# EAGLE design RPixel_V1 (EAGLE 9.5.2)

## Sheet 1 of 2
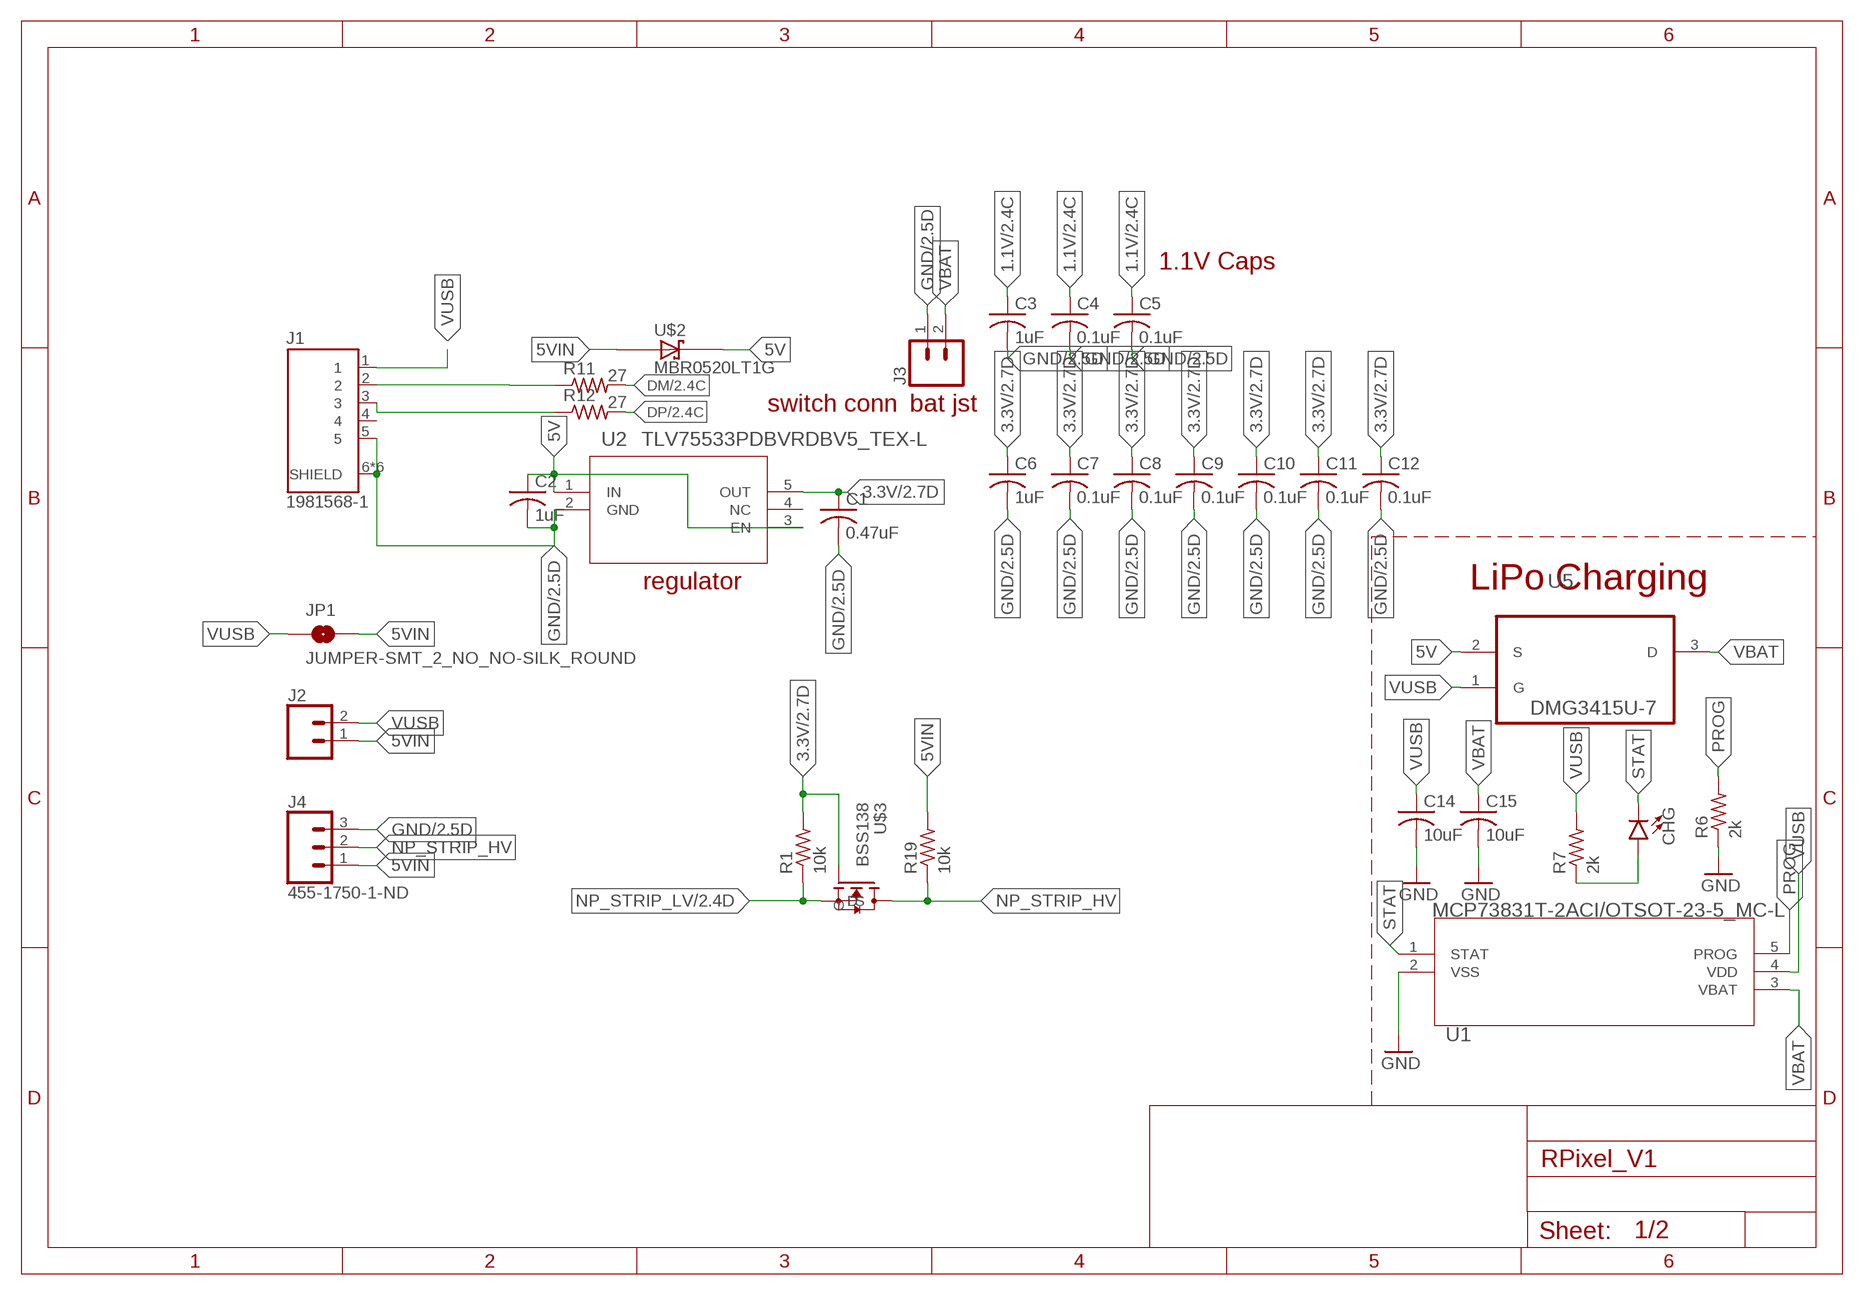
[diagram p0: schematic, sheet 1]

### Parts
C1  0.47uF  C-USC0805  [C0805]
C2  1uF  C-USC0805  [C0805]
C3  1uF  C-USC0402  [C0402]
C4  0.1uF  C-USC0402  [C0402]
C5  0.1uF  C-USC0402  [C0402]
C6  1uF  C-USC0402  [C0402]
C7  0.1uF  C-USC0402  [C0402]
C8  0.1uF  C-USC0402  [C0402]
C9  0.1uF  C-USC0402  [C0402]
C10  0.1uF  C-USC0402  [C0402]
C11  0.1uF  C-USC0402  [C0402]
C12  0.1uF  C-USC0402  [C0402]
C14  10uF  C-USC0603  [C0603]
C15  10uF  C-USC0603  [C0603]
CHG  LED0603  [LED-0603]
J1  1981568-1  [TE_1981568-1]
J2  CONN_02  [1X02]
J3  CONN_02-JST-2MM-SMT  [JST-2-SMD]
J4  455-1750-1-ND  CONN_03  [1X03]
JP1  JUMPER-SMT_2_NO_NO-SILK_ROUND  [SMT-JUMPER_2_NO_NO-SILK_ROUND]
R1  10k  R-US_R0603  [R0603]
R6  2k  R-US_R0603  [R0603]
R7  2k  R-US_R0603  [R0603]
R11  27  R-US_R0603  [R0603]
R12  27  R-US_R0603  [R0603]
R19  10k  R-US_R0603  [R0603]
U1  MCP73831T-2ACI/OTSOT-23-5_MC-L  [SOT-23-5_MC-L]
U2  TLV75533PDBVRDBV5_TEX-L  [DBV5_TEX-L]
U5  DMG3415U-7  [SOT95P240X105-3N]
U$2  MBR0520LT1G  [SOD3716X117(SOD-123)]
U$3  BSS138  [BSS138]

### Nets
1.1V: C3.1 C4.1 C5.1 ; also sheet 2
3.3V: C1.1 C6.1 C7.1 C8.1 C9.1 C10.1 C11.1 C12.1 R1.2 U2.5(OUT) U$3.G ; also sheet 2
5V: C2.1 U2.1(IN) U2.3(EN) U5.2(S) U$2.1(C)
5VIN: J2.1 J4.1 JP1.2 R19.2 U$2.2(A)
DM: R11.2 ; also sheet 2
DP: R12.2 ; also sheet 2
GND: C1.2 C2.2 C3.2 C4.2 C5.2 C6.2 C7.2 C8.2 C9.2 C10.2 C11.2 C12.2 C14.2 C15.2 J1.5 J1.6(SHIELD) J1.7(SHIELD) J1.8(SHIELD) J1.9(SHIELD) J1.10(SHIELD) J1.11(SHIELD) J3.1 J4.3 R6.1 U1.2(VSS) U2.2(GND) ; also sheet 2
N$1: CHG.A R7.1
N$4: J1.3 R12.1
N$11: J1.2 R11.1
NP_STRIP_HV: J4.2 R19.1 U$3.D
NP_STRIP_LV: R1.1 U$3.S ; also sheet 2
PROG: R6.2 U1.5(PROG)
STAT: CHG.C U1.1(STAT)
VBAT: C15.1 J3.2 U1.3(VBAT) U5.3(D)
VUSB: C14.1 J1.1 J2.2 JP1.1 R7.2 U1.4(VDD) U5.1(G)
Unconnected: J1.4 U2.4(NC)

### Notes on the sheet
- 1.1V Caps
- switch conn | bat jst
- regulator | LiPo Charging

## Sheet 2 of 2
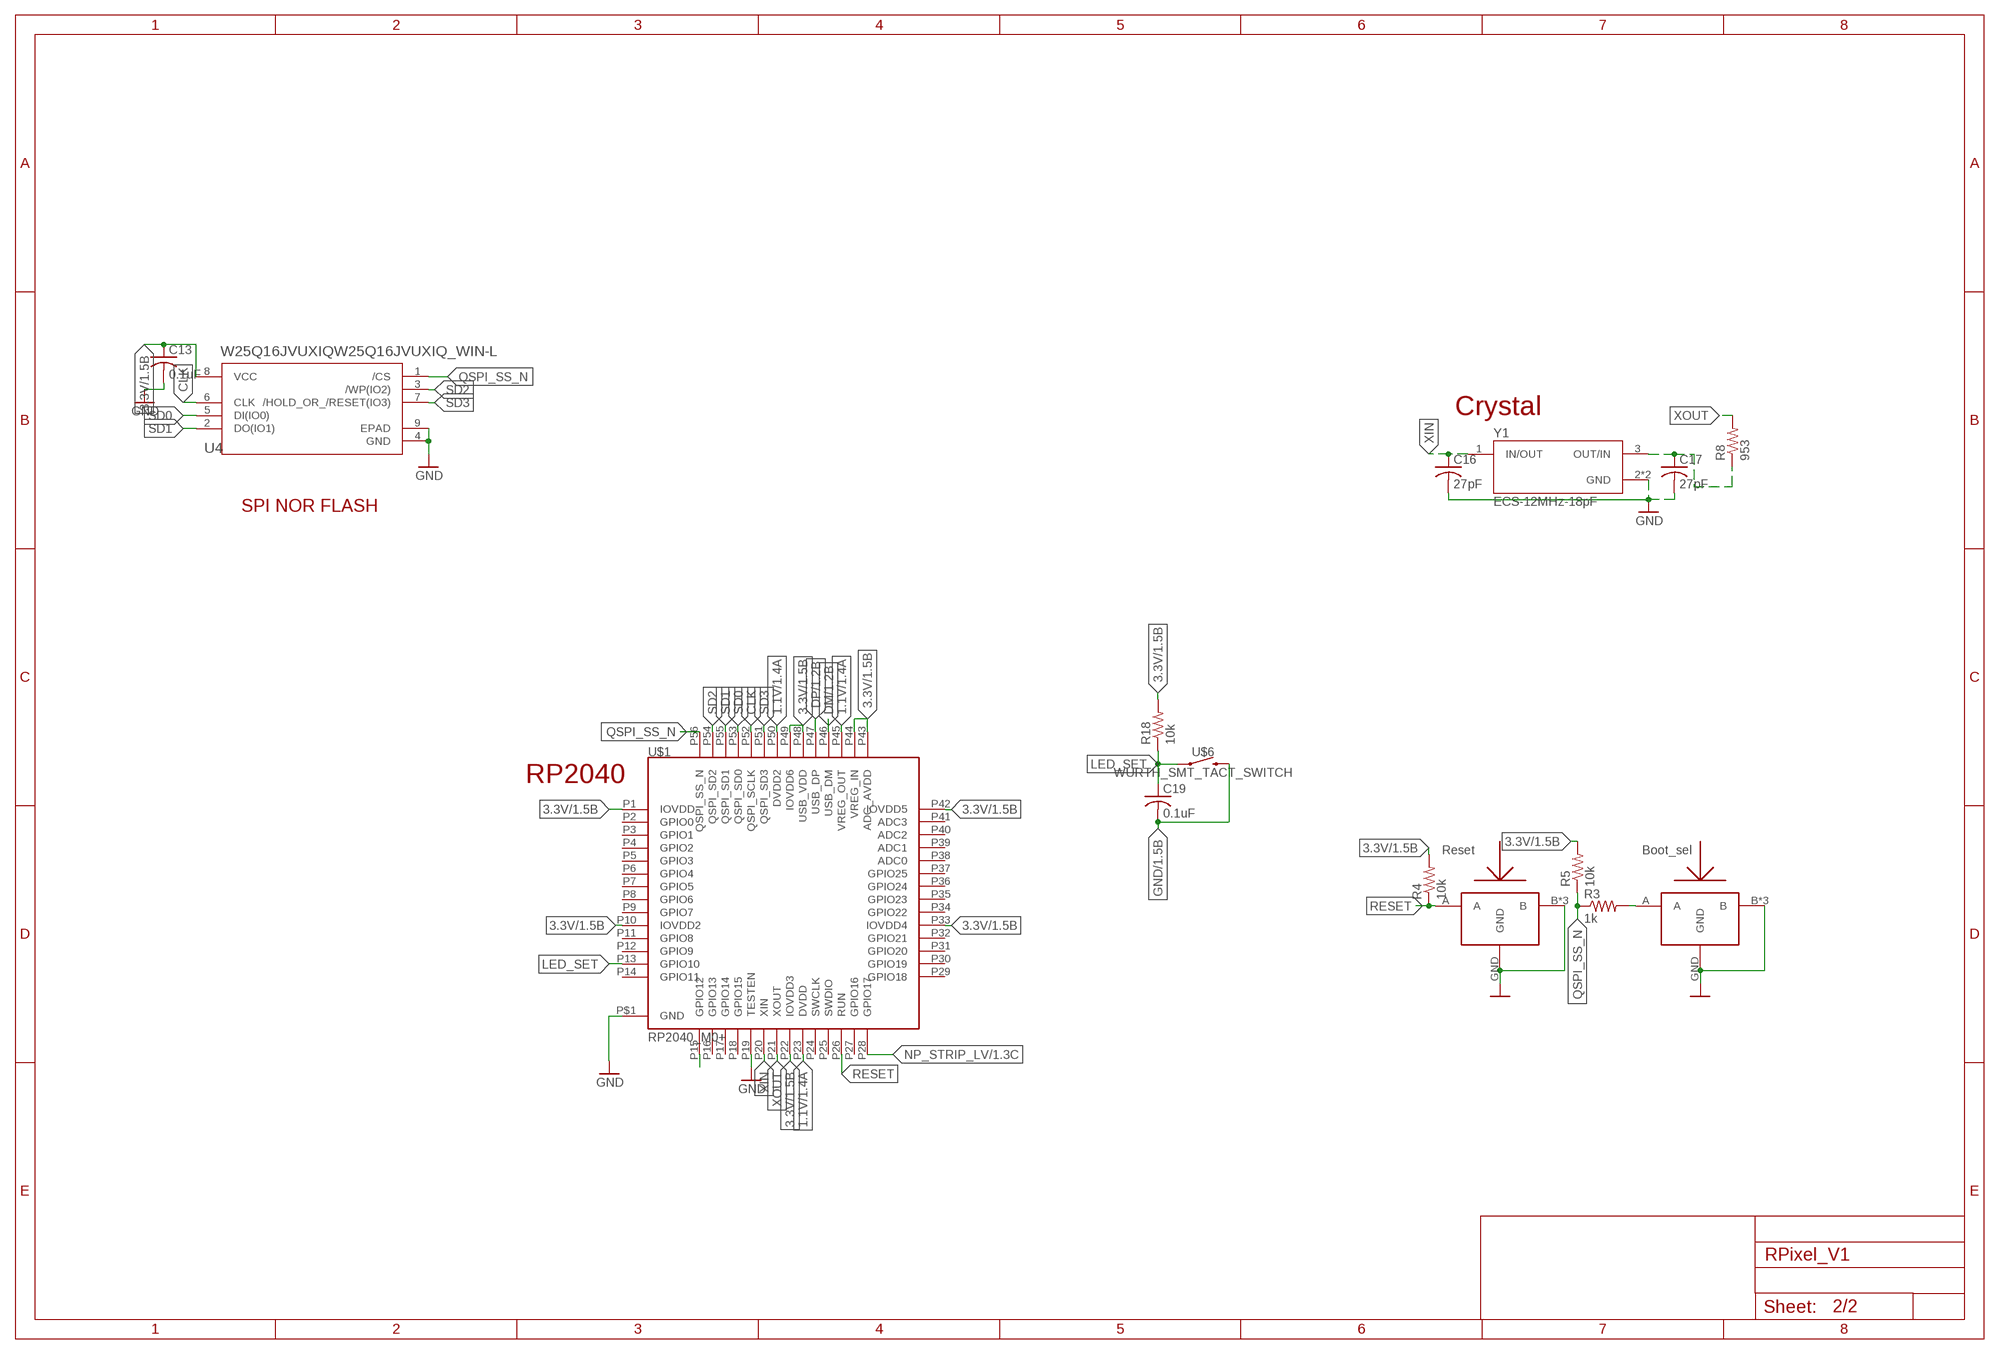
[diagram p1: schematic, sheet 2]

### Parts
C13  0.1uF  C-USC0402  [C0402]
C16  27pF  C-USC0402  [C0402]
C17  27pF  C-USC0402  [C0402]
C19  0.1uF  C-USC0402  [C0402]
R3  1k  R-US_R0402  [R0402]
R4  10k  R-US_R0402  [R0402]
R5  10k  R-US_R0402  [R0402]
R8  953  R-US_R0402  [R0402]
R18  10k  R-US_R0402  [R0402]
U4  W25Q16JVUXIQW25Q16JVUXIQ_WIN-L  [W25Q16JVUXIQ_WIN-L]
U$1  RP2040_M0+  [QFN-56]
U$4  SOF-232HST  [3.3X2.9]
U$5  SOF-232HST  [3.3X2.9]
U$6  WURTH_SMT_TACT_SWITCH  [SIDE_MOUNT_SWITCH]
Y1  ECS-12MHz-18pF  ECS-327ATQMV-AS-TR  [XTAL_ECS-327ATQMV-AS-TR]

### Nets
1.1V: U$1.P23(DVDD) U$1.P45(VREG_OUT) U$1.P50(DVDD2) ; also sheet 1
3.3V: C13.1 R4.2 R5.2 R18.2 U4.8(VCC) U$1.P1(IOVDD) U$1.P10(IOVDD2) U$1.P22(IOVDD3) U$1.P33(IOVDD4) U$1.P42(IOVDD5) U$1.P43(ADC_AVDD) U$1.P44(VREG_IN) U$1.P48(USB_VDD) U$1.P49(IOVDD6) ; also sheet 1
CLK: U4.6(CLK) U$1.P52(QSPI_SCLK)
DM: U$1.P46(USB_DM) ; also sheet 1
DP: U$1.P47(USB_DP) ; also sheet 1
GND: C13.2 C16.2 C17.2 C19.2 U4.4(GND) U4.9(EPAD) U$1.P19(TESTEN) U$1.P$1(GND) U$4.B U$4.B2(B) U$4.B3(B) U$4.GND U$5.B U$5.B2(B) U$5.B3(B) U$5.GND U$6.2 Y1.2(GND) Y1.4(GND) ; also sheet 1
LED_SET: C19.1 R18.1 U$1.P13(GPIO10) U$6.1
N$2: R3.2 U$5.A
N$6: C17.1 R8.1 Y1.3(OUT/IN)
NP_STRIP_LV: U$1.P28(GPIO17) ; also sheet 1
QSPI_SS_N: R3.1 R5.1 U4.1(/CS) U$1.P56(QSPI_SS_N)
RESET: R4.1 U$1.P26(RUN) U$4.A
SD0: U4.5(DI(IO0)) U$1.P53(QSPI_SD0)
SD1: U4.2(DO(IO1)) U$1.P55(QSPI_SD1)
SD2: U4.3(/WP(IO2)) U$1.P54(QSPI_SD2)
SD3: U4.7(/HOLD_OR_/RESET(IO3)) U$1.P51(QSPI_SD3)
SDA: U$1.P15(GPIO12)
XIN: C16.1 U$1.P20(XIN) Y1.1(IN/OUT)
XOUT: R8.2 U$1.P21(XOUT)
Unconnected: U$1.P2(GPIO0) U$1.P3(GPIO1) U$1.P4(GPIO2) U$1.P5(GPIO3) U$1.P6(GPIO4) U$1.P7(GPIO5) U$1.P8(GPIO6) U$1.P9(GPIO7) U$1.P11(GPIO8) U$1.P12(GPIO9) U$1.P14(GPIO11) U$1.P16(GPIO13) U$1.P17(GPIO14) U$1.P18(GPIO15) U$1.P24(SWCLK) U$1.P25(SWDIO) U$1.P27(GPIO16) U$1.P29(GPIO18) U$1.P30(GPIO19) U$1.P31(GPIO20) U$1.P32(GPIO21) U$1.P34(GPIO22) U$1.P35(GPIO23) U$1.P36(GPIO24) U$1.P37(GPIO25) U$1.P38(ADC0) U$1.P39(ADC1) U$1.P40(ADC2) U$1.P41(ADC3)

### Notes on the sheet
- Crystal
- SPI NOR FLASH
- RP2040
- Reset | Boot_sel

## Library data of the parts
C1-C17 C19 = rcl:C-US: CAPACITOR, American symbol; SPICEPREFIX: C
CHG = SparkFun-LED:LED: LED (Generic) Standard schematic elements and footprints for 5mm, 3mm, 1206, and 0603 sized LEDs. Generic LEDs with no color specified.
J1 = 1981568-1:1981568-1: CONN RCPT MICRO USB B R/A SMD; AVAILABILITY: Unavailable; DESCRIPTION: USB - micro B USB 2.0 Receptacle Connector 5 Position Surface Mount, Right Angle; MF: TE Connectivity; MP: 19815681; PACKAGE: None; PRICE: None; TE_PURCHASE_URL: https://www.te.com/usa-en/product-19815681.html?te_bu=Cor&te_type=disp&te_campaign=seda_glo_cor-seda-global-disp-prtnr-fy19-seda-model-bom-cta_sma-317_1&elqCampaignId=32493
J2 = SparkFun-Connectors:CONN_02: Multi connection point. Often used as Generic Header-pin footprint for 0.1 inch spaced/style header connections On any of the 0.1 inch spaced packages, you can populate with these: Break Away Headers - Straight <https://www.sparkfun.com/products/116> (PRT-00116) Break Away Male Headers - Right Angle <https://www.sparkfun.com/products/553> (PRT-00553) Female Headers <https://www.sparkfun.com/products/115> (PRT-00115) Break Away Headers - Machine Pin <https://www.sparkfun.com/products/117> (PRT-00117) Break Away Female Headers - Swiss Machine Pin <https://www.sparkfun.com/products/743> (PRT-00743) For SCREWTERMINALS and SPRING TERMINALS visit here: Screw Terimnals on SparkFun.com <https://www.sparkfun.com/search/results?term=Screw+Terminals> (5mm/3.5mm/2.54mm spacing) This device is also useful as a general connection point to wire up your design to another part of your project. Our various solder wires solder well into these plated through hole pads. Hook-Up Wire - Assortment (Stranded, 22 AWG) <https://www.sparkfun.com/products/11375> (PRT-11375) Hook-Up Wire - Assortment (Solid Core, 22 AWG) <https://www.sparkfun.com/products/11367> (PRT-11367) View the entire wire category on our website here <https://www.sparkfun.com/categories/141> Special notes: Molex polarized connector foot print use with: PRT-08233 with associated crimp pins and housings. 2.54_SCREWTERM for use with PRT-10571. 3.5mm Screw Terminal footprints for PRT-08084 5mm Screw Terminal footprints for use with PRT-08432
J3 = SparkFun-Connectors:CONN_02: Multi connection point. Often used as Generic Header-pin footprint for 0.1 inch spaced/style header connections On any of the 0.1 inch spaced packages, you can populate with these: Break Away Headers - Straight <https://www.sparkfun.com/products/116> (PRT-00116) Break Away Male Headers - Right Angle <https://www.sparkfun.com/products/553> (PRT-00553) Female Headers <https://www.sparkfun.com/products/115> (PRT-00115) Break Away Headers - Machine Pin <https://www.sparkfun.com/products/117> (PRT-00117) Break Away Female Headers - Swiss Machine Pin <https://www.sparkfun.com/products/743> (PRT-00743) For SCREWTERMINALS and SPRING TERMINALS visit here: Screw Terimnals on SparkFun.com <https://www.sparkfun.com/search/results?term=Screw+Terminals> (5mm/3.5mm/2.54mm spacing) This device is also useful as a general connection point to wire up your design to another part of your project. Our various solder wires solder well into these plated through hole pads. Hook-Up Wire - Assortment (Stranded, 22 AWG) <https://www.sparkfun.com/products/11375> (PRT-11375) Hook-Up Wire - Assortment (Solid Core, 22 AWG) <https://www.sparkfun.com/products/11367> (PRT-11367) View the entire wire category on our website here <https://www.sparkfun.com/categories/141> Special notes: Molex polarized connector foot print use with: PRT-08233 with associated crimp pins and housings. 2.54_SCREWTERM for use with PRT-10571. 3.5mm Screw Terminal footprints for PRT-08084 5mm Screw Terminal footprints for use with PRT-08432; PROD_ID: CONN-11443
J4 = SparkFun-Connectors:CONN_03: Multi connection point. Often used as Generic Header-pin footprint for 0.1 inch spaced/style header connections On any of the 0.1 inch spaced packages, you can populate with these: Break Away Headers - Straight <https://www.sparkfun.com/products/116> (PRT-00116) Break Away Male Headers - Right Angle <https://www.sparkfun.com/products/553> (PRT-00553) Female Headers <https://www.sparkfun.com/products/115> (PRT-00115) Break Away Headers - Machine Pin <https://www.sparkfun.com/products/117> (PRT-00117) Break Away Female Headers - Swiss Machine Pin <https://www.sparkfun.com/products/743> (PRT-00743) Stackable Header - 3 Pin (Female, 0.1") <https://www.sparkfun.com/products/13875> (PRT-13875) For SCREWTERMINALS and SPRING TERMINALS visit here: Screw Terimnals on SparkFun.com <https://www.sparkfun.com/search/results?term=Screw+Terminals> (5mm/3.5mm/2.54mm spacing) This device is also useful as a general connection point to wire up your design to another part of your project. Our various solder wires solder well into these plated through hole pads. Hook-Up Wire - Assortment (Stranded, 22 AWG) <https://www.sparkfun.com/products/11375> (PRT-11375) Hook-Up Wire - Assortment (Solid Core, 22 AWG) <https://www.sparkfun.com/products/11367> (PRT-11367) View the entire wire category on our website here <https://www.sparkfun.com/categories/141> Special notes: Molex polarized connector foot print use with SKU : PRT-08232 with associated crimp pins and housings.; PROD_ID: XXX-00000
JP1 = SparkFun-Jumpers:JUMPER-SMT_2_NO: Normally open jumper This jumper has two pads in close proximity to each other. Apply solder to close the connection. Round pads are easier to solder for beginners, but are a lot larger. SparkFun Product that uses the round pads: SparkFun EL Sequencer <https://www.sparkfun.com/products/12781>
R1 R3-R8 R11 R12 R18 R19 = rcl:R-US_: RESISTOR, American symbol; SPICEPREFIX: R
U1 = MCP73831-2ACI:MCP73831T-2ACI/OT; BUILT_BY: EMA_UL_Team; MANUFACTURER_PART_NUMBER: MCP73831T-2ACI/OT; VENDOR: Microchip
U2 = TLV75533pdbvr:TLV75533PDBVR; COPYRIGHT: Copyright (C) 2018 Accelerated Designs. All rights reserved; MANUFACTURER_PART_NUMBER: TLV75533PDBVR; SOURCELIBRARY: TI_2019-06-18; VENDOR: Texas Instruments
U4 = Winbond SPI Flash:W25Q16JVUXIQ; BUILT_BY: EMA_Colton; COPYRIGHT: Copyright (C) 2018 Accelerated Designs. All rights reserved; DATASHEET: https://www.mouser.com/datasheet/2/949/w25n01gw_reve_021318_unsecured-1489855.pdf; MANUFACTURER_PART_NUMBER: W25Q16JVUXIQ; SOURCELIBRARY: Winbond_2020-03-18; VENDOR: Winbond
U5 = DMG3415U-7:DMG3415U-7: P-CHANNEL ENHANCEMENT MODE MOSFET; AVAILABILITY: Unavailable; DESCRIPTION: P-Channel 20V 4A _Ta_ 900mW _Ta_ Surface Mount SOT-23-3; MF: Diodes Inc.; MP: DMG3415U-7; PACKAGE: SOT-23-3 Diodes Inc.; PRICE: None
U$1 = RP2040_M0:RP2040_M0+
U$2 = MBR0520LT1G:MBR0520LT1G: Surface Mount Schottky Power Rectifier Plastic SOD−123 Package; AVAILABILITY: Unavailable; DESCRIPTION: Diode Schottky 20V 500mA Surface Mount SOD-123; MF: ON Semiconductor; MP: MBR0520LT1G; PACKAGE: SOD-123 ON Semiconductor; PRICE: None
U$3 = BSS138:BSS138: BSS138 N-Channel Logic Level Enhancement Mode Field Effect Transistor; AVAILABILITY: Unavailable; DESCRIPTION: N-Channel 50V 220mA _Ta_ 360mW _Ta_ Surface Mount Die; MF: MICROSS/On Semiconductor; MP: BSS138; PACKAGE: TO-236-3 Micross; PRICE: None
U$4 U$5 = Mitsumi Buttons:SOF-232HST
U$6 = Wurth Switches:WURTH_SMT_TACT_SWITCH
Y1 = ECS-327ATQMV-AS-TR:ECS-327ATQMV-AS-TR: The ECX-33Q is a miniature SMD Crystal with a 3.2 x 2.5 mm footprint. AEC-Q200 Qualified.; ARROW_ELECTRONICS-PURCHASE-URL: https://snapeda.com/shop?store=Arrow+Electronics&id=3210300; DESCRIPTION: 32.768kHz XO (Standard) CMOS Oscillator 1.62V ~ 3.63V Enable/Disable 4-SMD, No Lead; DIGI-KEY_PART_NUMBER: XC2826CT-ND; MF: ECS Inc.; MOUSER-PURCHASE-URL: https://snapeda.com/shop?store=Mouser&id=3210300; MP: ECS-327ATQMV-AS-TR; PACKAGE: SMD-4 ECS Inc.

## Net classes
0 default: width 0.152 mm, clearance 0.127 mm

## Board
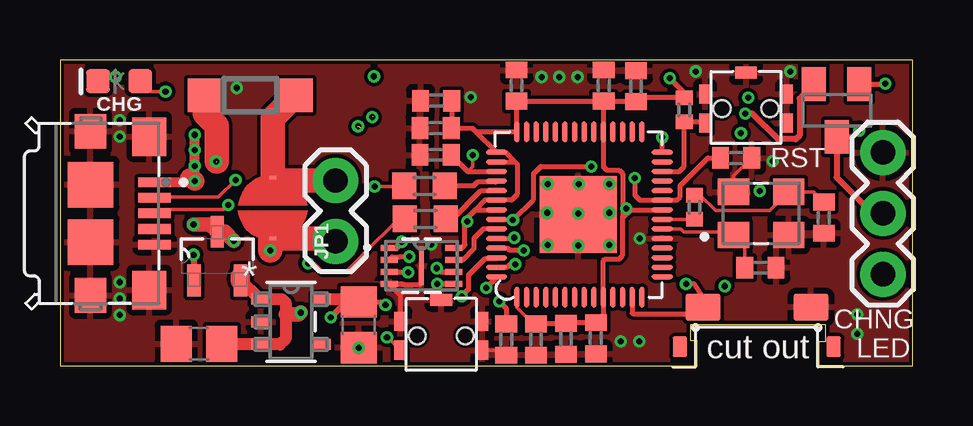
[diagram p2: board, top side]
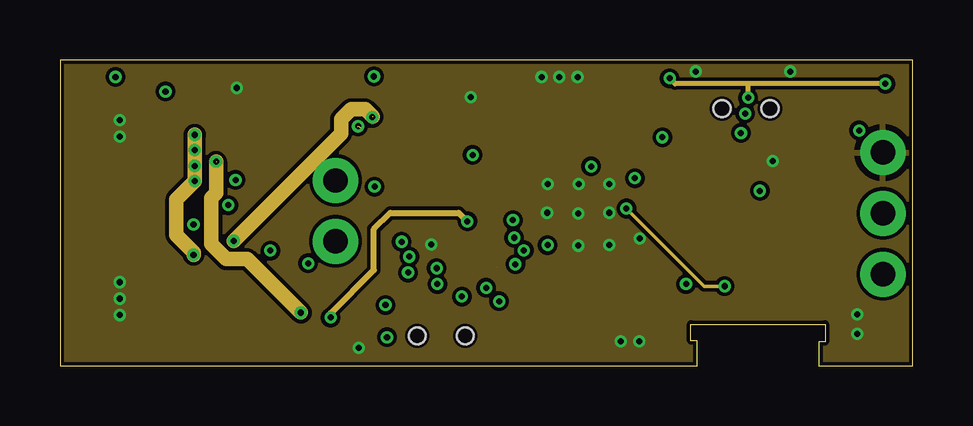
[diagram p3: board, inner layer Route2]
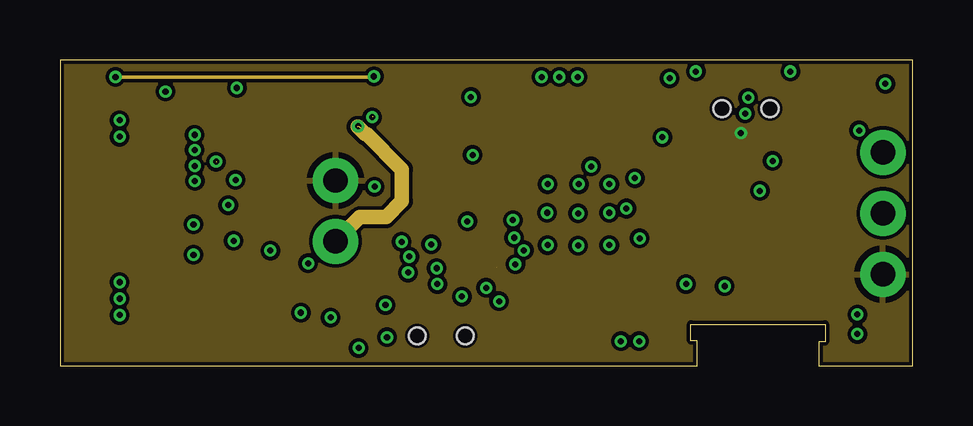
[diagram p4: board, inner layer Route15]
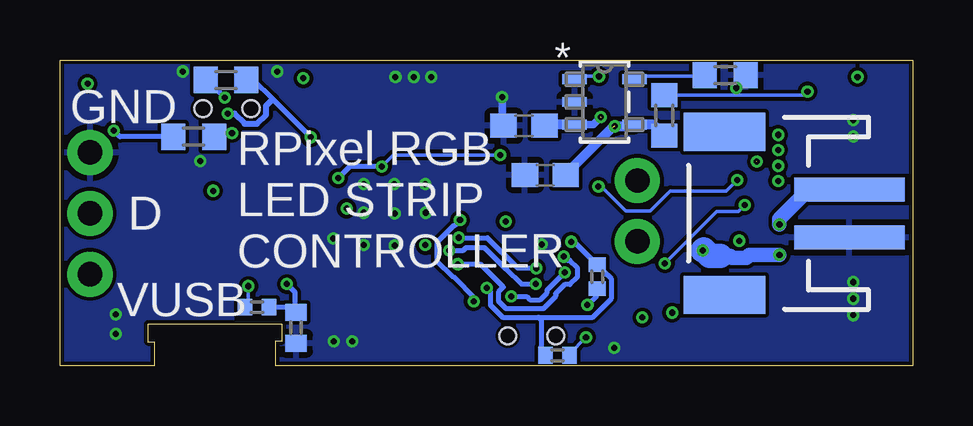
[diagram p5: board, bottom side, seen from below]

Size 35.54 x 12.75 mm. Coordinates in mm from the lower left corner, seen from the top.
Outline: 35.54,0 35.54,12.75 0,12.75 0,0 26.54,0 26.54,1.04 26.29,1.04 26.29,1.73 31.88,1.73 31.88,0.99 31.62,0.99 31.62,0 35.54,0
Copper layers (1+2*15+16): Top 0.035mm / dielectric 1.5mm / Route2 0.035mm / dielectric 0.15mm / Route15 0.035mm / dielectric 0.2mm / Bottom 0.035mm
Design rules "default *": minimum track width 6mil, minimum drill 10mil, track to track 6mil, track to pad 6mil, pad to pad 6mil, via to via 6mil, smd to smd 6mil, copper to edge 6mil, drill to drill 6mil, minimum pad ring 5mil, minimum via ring 5mil, stop-mask expansion 1mil, vias tented up to drill 12mil, thermal gap 10mil

### Footprints (pad centres in the part's own frame; a part is rotated, then mirrored left to right if it is on the bottom)
C0805 = smd 1.3 x 1.5: 1 -0.95,0; 2 0.95,0
C0402 = smd 0.7 x 0.9: 1 -0.65,0; 2 0.65,0
C0603 = smd 1.1 x 1: 1 -0.85,0; 2 0.85,0
LED-0603 = smd 1 x 1: A -0.877,0; C 0.877,0
TE_1981568-1 = smd 0.4 x 1.35: 1 -1.3,2.675; 2 -0.65,2.675; 3 0,2.675; 4 0.65,2.675; 5 1.3,2.675 | smd 1.6 x 1.4: 6 -3.2,2.45; 7 3.2,2.45 | smd 1.45 x 1.3: 8 3.425,0; 9 -3.425,0 | smd 1.9 x 1.9: 10 -1.2,0; 11 1.2,0
1X02 = drill 1.016 pad 1.88: 1 0,0; 2 2.54,0
JST-2-SMD = smd 1 x 4.6: 1 -1,-3.7; 2 1,-3.7 | smd 1.6 x 3.4: NC1 -3.4,1.5; NC2 3.4,1.5
1X03 = drill 1.016 pad 1.88: 1 0,0; 2 2.54,0; 3 5.08,0
SMT-JUMPER_2_NO_NO-SILK_ROUND = smd 0.152 x 0.305: 1 -1.27,0; 2 1.27,0
R0603 = smd 1 x 1.1: 1 -0.85,0; 2 0.85,0
R0402 = smd 0.6 x 0.7: 1 -0.5,0; 2 0.5,0
SOT-23-5_MC-L = smd 1.016 x 0.406: 1 -1.245,0.95; 2 -1.245,0; 3 -1.245,-0.95; 4 1.245,-0.95; 5 1.245,0.95
DBV5_TEX-L = smd 0.775 x 0.457: 1 -1.264,0.95; 2 -1.264,0; 3 -1.264,-0.95; 4 1.264,-0.95; 5 1.264,0.95
W25Q16JVUXIQ_WIN-L = smd 0.711 x 0.254: 1 -1.348,0.75; 2 -1.348,0.25; 3 -1.348,-0.25; 4 -1.348,-0.75; 5 1.348,-0.75; 6 1.348,-0.25; 7 1.348,0.25; 8 1.348,0.75 | smd 0.203 x 1.6: 9 0,0
SOT95P240X105-3N = smd 1.321 x 0.559: 1 -1.016,0.965; 2 -1.016,-0.965; 3 1.016,0
QFN-56 = smd 0.875 x 0.2: P1 -3.5,2.55; P2 -3.5,2.15; P3 -3.5,1.75; P4 -3.5,1.35; P5 -3.5,0.95; P6 -3.5,0.55; P7 -3.5,0.15; P8 -3.5,-0.25; P9 -3.5,-0.65; P10 -3.5,-1.05; P11 -3.5,-1.45; P12 -3.5,-1.85; P13 -3.5,-2.25; P14 -3.5,-2.65; P29 3.4,-2.65; P30 3.4,-2.25; P31 3.4,-1.85; P32 3.4,-1.45; P33 3.4,-1.05; P34 3.4,-0.65; P35 3.4,-0.25; P36 3.4,0.15; P37 3.4,0.55; P38 3.4,0.95; P39 3.4,1.35; P40 3.4,1.75; P41 3.4,2.15; P42 3.4,2.55 | smd 0.2 x 0.875: P15 -2.65,-3.5; P16 -2.25,-3.5; P17 -1.85,-3.5; P18 -1.45,-3.5; P19 -1.05,-3.5; P20 -0.65,-3.5; P21 -0.25,-3.5; P22 0.15,-3.5; P23 0.55,-3.5; P24 0.95,-3.5; P25 1.35,-3.5; P26 1.75,-3.5; P27 2.15,-3.5; P28 2.55,-3.5; P43 2.55,3.4; P44 2.15,3.4; P45 1.75,3.4; P46 1.35,3.4; P47 0.95,3.4; P48 0.55,3.4; P49 0.15,3.4; P50 -0.25,3.4; P51 -0.65,3.4; P52 -1.05,3.4; P53 -1.45,3.4; P54 -1.85,3.4; P55 -2.25,3.4; P56 -2.65,3.4 | smd 3.2 x 3.2: P$1 -0.05,0
SOD3716X117(SOD-123) = smd 1.4 x 1.4: 1 -1.9,0.051; 2 1.9,0.051
BSS138 = smd 1 x 1.4: D 0,1.1; G -0.95,-1.1; S 0.95,-1.1
3.3X2.9 = smd 0.5 x 0.8: A -0.7,-0.6; B2 2.7,0.6; B3 2.7,-0.6; GND -0.7,0.6 | smd 0.9 x 0.5: B 1,1.5 | hole 0.7: 0,0; 2,0
SIDE_MOUNT_SWITCH = smd 1.45 x 1.1: 1 -2.265,1.515; 2 2.235,1.515 | smd 0.6 x 0.85: 3 -3.215,-0.135; 4 3.185,-0.135
XTAL_ECS-327ATQMV-AS-TR = smd 1.3 x 1.1: 1 -1.15,-0.9; 2 1.15,-0.9; 3 1.15,0.9; 4 -1.15,0.9

### Placement (x,y rotation side)
C1  12.45,1.7 270 top
C2  5.79,0.91 180 top
C3  15.65,8.79 180 top
C4  18.59,1.09 270 top
C5  28.17,8.66 0 top
C6  15.65,9.91 180 top
C7  15.67,11.05 180 top
C8  19.02,11.68 90 top
C9  22.66,11.68 90 top
C10  24,11.66 90 top
C11  19.84,1.09 270 top
C12  21.08,1.12 270 top
C13  22.33,1.14 270 top
C14  15.32,7.95 180 bottom
C15  16.21,10.01 180 bottom
C16  29.18,4.09 0 top
C17  31.83,6.17 270 top
C19  25.7,1.57 270 bottom
CHG  2.46,11.86 180 top
J1  1.27,6.35 270 top
J2  11.48,7.72 270 top
J3  6.35,6.35 90 bottom
J4  34.29,3.81 90 top
JP1  8.86,6.58 90 top
R1  28.63,11.91 180 bottom
R3  14.81,0.43 0 bottom
R4  26.01,10.67 90 top
R5  13.16,3.71 270 bottom
R6  7.82,12.12 180 bottom
R7  10.36,10.44 270 bottom
R8  26.44,6.6 270 top
R11  15.19,7.49 0 top
R12  15.21,6.12 0 top
R18  27.33,2.44 180 bottom
R19  29.97,9.55 0 bottom
U1  12.85,11 0 bottom
U2  9.63,1.83 0 top
U4  15.06,4.17 0 top
U5  6.55,4.57 90 top
U$1  21.59,6.35 90 top
U$2  7.92,11.23 0 top
U$3  32.36,10.64 180 top
U$4  27.58,10.72 0 top
U$5  14.88,1.24 0 top
U$6  29.05,0.92 0 top
Y1  29.21,6.35 0 top

### Tracks (layer width: path | path; a pad name or v marks a point on that pad's centre or on a via)
1.1V  (via drill 0.25)
  Top 0.152: 16.98,8.1 17.2,8.31 v17.2,8.79
  Top 0.203: U$1.P50 18.84,6.1 v18.87,6.07 19.74,6.93 19.74,8.01 20.04,8.31 v22.13,8.31 | v18.3,2.68 18.59,2.39 C4.1 | C5.1 26.99,8.66 25.84,7.51 25.84,7.04 25.7,6.9 U$1.P23 24.16,6.9 23.95,7.11 v23.95,7.82 | C3.1 16.98,8.1 U$1.P45
  Bottom 0.152: v17.2,8.79 21.65,8.79 v22.13,8.31
  Bottom 0.203: v18.87,6.07 19.1,5.84 19.13,5.84 19.83,5.14 19.83,4.37 19.18,3.72 19.16,3.72 18.21,2.77 v18.3,2.68 | v22.13,8.31 23.47,8.31 v23.95,7.82
3.3V  (via drill 0.25)
  Top 0.152: U$1.P1 19.04,2.42 19.72,1.74 C11.1 | v23.6,6.55 23.44,6.55
  Top 0.203: U4.8 16.74,4.92 16.87,5.04 16.87,6.07 16.94,6.15 17.3,6.5 | 17.3,6.5 U$1.P49 | 17.3,6.5 17.7,6.9 U$1.P48 18.81,6.9 19.05,7.14 19.05,8.41 18.96,8.5 | C11.1 19.86,1.77 C12.1 21.11,1.79 C13.1 22.64,2.11 U$1.P10 22.64,4.38 22.71,4.45 23.3,4.45 23.44,4.59 23.44,6.17 23.47,6.2 | U$1.P22 23.77,6.5 23.47,6.2 | 22.64,11.02 C9.1 23.98,11.03 C10.1 24.16,11.17 R4.2 26.01,11.38 v25.4,11.99 | 22.64,11.02 U$1.P33 22.64,8.3 22.78,8.15 23.3,8.15 23.44,8.01 23.44,6.55 23.44,6.22 23.47,6.2 | 22.64,11.02 22.62,11.03 C8.1 19.04,11.02 U$1.P42 17.34,9.75 | 17.34,9.75 U$1.P43 18.56,8.9 18.96,8.5 | 17.34,9.75 17.18,9.91 C6.1 16.32,9.93 C7.1 | U$1.P44 18.96,8.5 | U$3.G 34.37,11.74 v34.39,11.76 | C1.1 13.44,2.65 v13.56,2.53
  Top 0.254: C1.1 11.92,2.65 v11.28,2.01 | v16.97,6.02 16.94,6.05 16.94,6.15
  Top 0.508: U2.5 12.32,2.78 C1.1
  Route2 0.152: v27.7,3.31 26.84,3.31 v23.6,6.55
  Route2 0.203: v34.39,11.76 28.68,11.76 | 28.68,11.76 25.63,11.76 v25.4,11.99 | v28.68,11.18 28.68,11.76
  Route2 0.254: v11.28,2.01 11.28,2.18 13.08,3.99 13.08,5.69 13.77,6.38 16.61,6.38 v16.97,6.02
  Bottom 0.152: R18.2 27.7,2.57 v27.7,3.31
  Bottom 0.203: R1.2 29.41,11.91 v28.68,11.18 | v13.56,2.53 13.16,2.93 R5.2
5V  (via drill 0.25)  (1 unrouted)
  Top 0.508: U5.2 8.3,2.78 U2.1 9.23,2.78 9.4,2.62 9.4,2.13 9.4,1.12 9.16,0.88 U2.3 8.33,0.91 C2.1
  Top 0.61: v10.03,2.21 9.96,2.13 9.4,2.13
  Top 0.813: U5.2 7.52,3.71
  Top 1.016: U$2.1 6.03,10.51 6.53,10.01 6.53,8.51
  Route2 0.61: v6.5,8.51 6.5,7.19 6.3,6.99 6.3,5.07 6.92,4.45 7.8,4.45 v10.03,2.21
5VIN  (via drill 0.25)
  Top 1.016: U$2.2 8.87,10.32 JP1.2 8.99,7.72 J2.1
  Bottom 0.254: R19.2 28.97,9.7 v28.37,9.7
  pour Route15: -3.81,16.51 39.37,16.51 39.37,-2.54 -3.81,-2.54
CLK  (via drill 0.25)
  Top 0.203: U$1.P52 18.89,5.3 v18.92,5.33 | v15.7,4.06 15.85,3.92 U4.6
  Bottom 0.203: v18.92,5.33 17.73,5.33 16.46,4.06 v15.7,4.06
DM
  Top 0.203: U$1.P46 18.15,7.66 17.39,7.66 17.23,7.49 R11.2
DP
  Top 0.203: R12.2 16.36,6.12 17.54,7.3 U$1.P47
GND  (via drill 0.25)
  Top 0.152: Y1.4 28.06,7.9 C5.2 | U$5.B3 18.39,0.65 C4.2
  Top 0.203: U4.9 15.06,3.43 15.01,3.38 14.29,3.38 14.26,3.42 U4.4 14.18,2.95 U$5.GND
  Bottom 0.152: v7.37,11.58 6.97,11.97 R6.1
  Bottom 0.305: C15.2 17.12,10.07 v17.12,11.2
  other vias: 2.49,2.11 2.49,2.79 2.49,3.48 2.49,9.55 2.49,10.24 30.43,12.27 29.69,8.53 26.49,12.27 24.16,5.31 21.56,12.04 20.8,12.04 20.07,12.04 21.59,5 22.89,5.03 22.89,6.38 21.59,6.35 20.29,6.38 20.32,7.57 21.62,7.57 22.89,7.57 24.13,1.02 23.37,1.02 33.22,2.13 33.22,1.32 12.45,0.74 15.47,5.05
  pour Route2: -2.54,15.24 38.1,15.24 38.1,-1.27 -2.54,-1.27
  pour Top: -5.08,17.78 40.64,17.78 40.64,-3.81 -5.08,-3.81
  pour Bottom: -6.35,19.05 41.91,19.05 41.91,-5.08 -6.35,-5.08
LED_SET  (via drill 0.25)
  Top 0.203: U$1.P13 23.84,2.19 23.88,2.16 27.24,2.16 U$6.1 26.78,2.86 26.43,3.4 v26.09,3.4
  Bottom 0.203: v26.09,3.4 25.76,3.07 25.76,2.28 C19.1 25.92,2.44 R18.1
N$1  (via drill 0.25)
  Top 0.152: v4.39,11.43 3.77,11.43 CHG.A
  Bottom 0.152: R7.1 4.54,11.29 v4.39,11.43
N$2  (via drill 0.25)
  Top 0.152: U$5.A 13.65,1.18 v13.62,1.18
  Bottom 0.152: v13.62,1.18 14.31,0.5 R3.2
N$4  (via drill 0.25)
  Top 0.152: v10.34,4.27 10.59,4.27 10.95,3.91 11.91,3.91 12.6,4.6 12.6,4.61 14.12,6.12 R12.1 | v7.01,6.7 6.83,6.52 4.11,6.52 J1.3
  Bottom 0.152: v10.34,4.27 8.18,6.43 7.28,6.43 v7.01,6.7
N$6
  Top 0.152: R8.1 26.68,7.1 27.32,6.47 29.58,6.47 Y1.3 31.4,7.25 C17.1
N$11  (via drill 0.25)
  Top 0.152: J1.2 3.97,7.03 6.59,7.03 v7.32,7.75 | v13.11,7.47 14.31,7.47 R11.1
  Bottom 0.152: v7.32,7.75 7.77,7.29 10.11,7.29 10.95,6.45 11.96,6.45 12.98,7.47 v13.11,7.47
N$13  (via drill 0.25)
  other vias: 20.32,5.03
N$19  (via drill 0.25)
  other vias: 29.16,7.29
NP_STRIP_HV  (via drill 0.25)
  Top 0.203: v33.3,9.8 33.02,9.53 32.36,9.53
  Top 0.254: U$3.D 32.36,9.53 32.36,7.85 33.86,6.35 J4.2
  Bottom 0.203: R19.1 33.05,9.55 v33.3,9.8
NP_STRIP_LV  (via drill 0.25)
  Top 0.203: U$1.P28 v25.09,9.52 v25.09,9.53
  Top 0.254: U$3.S 30.81,11.15 30.81,9.6 30.65,9.44 29.92,9.44 28.84,10.52 v28.55,10.52
  Bottom 0.203: v25.09,9.53 26.68,11.11 27.48,11.91 R1.1
  Bottom 0.254: v28.55,10.52 28.27,10.52 27.84,10.09 27.32,10.09 26.95,10.46 26.95,10.84 26.68,11.11
PROG
  Bottom 0.152: U1.5 11.48,12.07 8.71,12.07 R6.2
QSPI_SS_N  (via drill 0.25)
  Top 0.203: U$1.P56 18.19,3.68 v17.76,3.25 | v14.24,5.17 13.99,4.92 U4.1
  Bottom 0.203: v17.76,3.25 17.6,3.09 17.6,2.52 17.1,2.02 15.6,2.02 | R3.1 15.31,0.61 15.49,0.79 15.49,1.91 15.6,2.02 | 15.6,2.02 13.34,2.02 12.55,2.8 12.55,3.61 12.7,3.76 12.71,3.76 R5.1 14.11,5.17 v14.24,5.17
RESET
  Top 0.203: U$1.P26 25.8,8.1 26.01,8.31 R4.1 26.84,10.17 U$4.A
SD0  (via drill 0.25)
  Top 0.203: U$1.P53 18.64,4.9 18.71,4.83 19.3,4.83 v19.33,4.8 | v15.72,3.4 16.01,3.4 16.02,3.42 U4.5
  Bottom 0.203: v19.33,4.8 18.73,4.8 18.61,4.92 17.85,4.92 16.97,4.04 16.94,4.04 16.3,3.4 v15.72,3.4
SD1  (via drill 0.25)  (1 unrouted)
  Top 0.203: U4.2 13.83,4.54 14.18,4.54 14.19,4.55 v14.55,4.55 | v18.97,4.23 18.75,4.23 18.63,4.1 U$1.P55
  Bottom 0.203: v14.55,4.55 14.4,4.39 14.29,4.39 13.99,4.1 13.99,3.68 14.29,3.38 14.51,3.38 14.88,3 14.88,2.89 15.4,2.37 16.95,2.37 17.25,2.67 17.25,3.09 17.07,3.27 18.02,4.23 v18.97,4.23
SD2  (via drill 0.25)
  Top 0.203: U$1.P54 18.14,4.45 17.71,4.45 17.02,3.77 17.02,3.18 16.74,2.9 v16.74,2.88 | v14.5,3.89 13.74,3.89 U4.3
  Bottom 0.203: v16.74,2.88 16.1,2.88 15.96,2.74 15.54,2.74 15.24,3.04 15.24,3.15 v14.5,3.89
SD3
  Top 0.203: U$1.P51 17.64,5.7 17.25,5.31 17.25,4.88 16.79,4.42 U4.7
STAT  (via drill 0.25)
  Top 0.152: CHG.C 1.76,12.04 v2.31,12.04
  Route15 0.152: v2.31,12.04 13.06,12.04 v13.08,12.06
  Bottom 0.152: v13.08,12.06 13.98,12.06 U1.1
VBAT  (via drill 0.25)  (1 unrouted)
  Top 0.61: v5.56,5.89 6.25,5.89 U5.3 6.86,5.59 v7.24,5.21
  Route2 0.61: 13.03,10.38 12.71,10.69 12.13,10.69 11.71,10.28 11.71,9.68 v7.24,5.21
  Bottom 0.305: v13.01,10.36 13.32,10.05 U1.3
  Bottom 0.406: U1.3 15.31,10.05 C15.1
  Bottom 0.61: J3.2 4.33,7.35 5.56,6.12 v5.56,5.89
VUSB  (via drill 0.25)  (2 unrouted)
  Top 0.254: U5.1 5.59,4.6 v5.56,4.62
  Top 0.406: J1.1 5.24,7.65 5.41,7.82 | v5.62,7.7 v5.61,7.71 v5.61,8.33 v5.61,8.99 v5.61,9.63
  Top 0.813: v5.62,7.7 5.5,7.82 5.41,7.82
  Top 1.016: J2.2 11.35,5.31 JP1.1 8.76,5.21 v8.76,4.8
  Route2 0.61: v5.56,4.62 5.56,4.73 4.85,5.44 4.85,6.93 v5.62,7.7 v5.62,9.62 v5.61,9.63
  Route15 0.61: J2.2 12.5,6.2 13.59,6.2 14.25,6.86 14.25,8.18 12.78,9.65 12.71,9.65 12.4,9.96
  Bottom 0.406: 10.18,9.59 R7.2 10.82,10.05 U1.4 11.67,9.98 v12.42,9.98 | C14.1 14.47,7.99 12.52,9.93
  Bottom 0.61: v5.56,4.62 6.82,4.62 6.94,4.5 7.53,4.5 7.61,4.57 8.03,4.57
  Bottom 1.016: 8.03,4.57 8.46,4.57 8.72,4.84 v8.76,4.8
XIN
  Top 0.152: U$1.P20 25.87,5.7 26,5.58 27.93,5.58 Y1.1 28.54,4.97 C16.1
XOUT
  Top 0.152: R8.2 U$1.P21

### Text on the board
tPlace: RST | CHNG / LED
bPlace: GND | D | RPixel RGB / LED STRIP / CONTROLLER | VUSB